# Altium project CT310高端控制盒基板电路V1.1.PrjPcb (part 2 of 2)
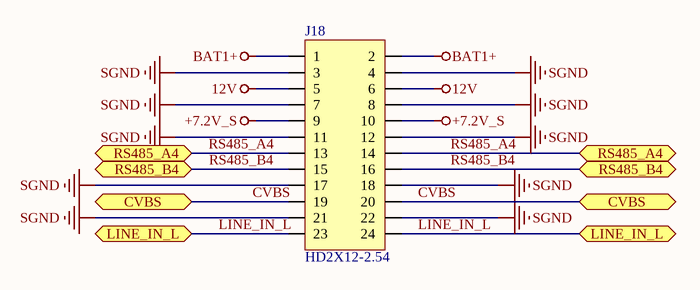
[diagram p13: DataVideoPort.SchDoc]

## Nets that join several sheets
12V: KeyInput_MG (R4.1 R5.1), PowerManager (10 pins), LeftInterface (J17.6), PowerConvert (10 pins), DataVideoPort (J18.5 J18.6)
12V_OUT: OmapSystem (J14.7 J14.8 J14.9 J14.10), PowerManager (K1.5)
+2.5V_S: Processor (C90.1 C91.1 C94.1 U5.21), JoyStickAdcInput (6 pins), PowerConvert (C82.2 C83.2 C84.2 U4.6)
+3.3V_S: Processor (20 pins), KeyInput_IJMEF (10 pins), KeyInput_ABH (21 pins), OmapSystem (R45.1 R53.1), KeyInput_MG (9 pins), TTL_TO_RS232 (C108.1 C112.2 IC1.16), TTL_TO_RS485 (9 pins), PowerConvert (C6.1 C9.2 L1.1)
+5V_OUT: OmapSystem (J13.1 J13.2 J13.3 J13.4), PowerManager (K1.4)
+5V_S: PowerManager (K1.3), LeftInterface (J17.4), PowerConvert (14 pins)
+7.2V_S: PowerConvert (7 pins), DataVideoPort (J18.9 J18.10)
BAT1+: PowerManager (F1.1 K2.3), DataVideoPort (J18.1 J18.2)
SGND: Processor (27 pins), KeyInput_IJMEF (12 pins), JoyStickAdcInput (10 pins), KeyInput_ABH (24 pins), OmapSystem (10 pins), KeyInput_MG (15 pins), PowerManager (23 pins), LeftInterface (7 pins), TTL_TO_RS232 (5 pins), TTL_TO_RS485 (12 pins), PowerConvert (39 pins), DataVideoPort (10 pins)
BAT1_ADC: Processor (U5.23), PowerManager (C15.1 C17.1 R21.2 R27.2)
BAT2_ADC: Processor (U5.24), PowerManager (C16.1 C18.1 R22.2 R28.2)
CVBS: OmapSystem (R46.2 R51.2), DataVideoPort (J18.19 J18.20)
JoyStick_LeftX: Processor (U5.16), JoyStickAdcInput (C23.1 R6.1)
JoyStick_LeftY: Processor (U5.17), JoyStickAdcInput (C25.1 R8.1)
JoyStick_RightX: Processor (U5.26), JoyStickAdcInput (C24.1 R7.1)
JoyStick_RightY: Processor (U5.25), JoyStickAdcInput (C26.1 R29.1)
KeySwIn_ED: Processor (U5.61), KeyInput_IJMEF (C51.1 J16.2 R60.1)
KeySwIn_EL: Processor (U5.60), KeyInput_IJMEF (C54.1 J16.3 R66.1)
KeySwIn_EM: Processor (U5.62), KeyInput_IJMEF (C60.1 J16.5 R78.1)
KeySwIn_ER: Processor (U5.81), KeyInput_IJMEF (C57.1 J16.4 R72.1)
KeySwIn_EU: Processor (U5.82), KeyInput_IJMEF (C48.1 J16.1 R55.1)
KeySwIn_FD: Processor (U5.33), KeyInput_IJMEF (C52.1 J15.2 R61.1)
KeySwIn_FL: Processor (U5.32), KeyInput_IJMEF (C55.1 J15.3 R67.1)
KeySwIn_FM: Processor (U5.31), KeyInput_IJMEF (C61.1 J15.5 R79.1)
KeySwIn_FR: Processor (U5.30), KeyInput_IJMEF (C58.1 J15.4 R73.1)
KeySwIn_FU: Processor (U5.29), KeyInput_IJMEF (C49.1 J15.1 R56.1)
KeySwIn_G1: Processor (U5.63), KeyInput_MG (C63.1 J9.1 R86.1)
KeySwIn_G2: Processor (U5.64), KeyInput_MG (C65.1 J9.3 R90.1)
KeySwIn_H1: Processor (U5.34), KeyInput_ABH (C27.1 J1.1 R13.1)
KeySwIn_H2: Processor (U5.35), KeyInput_ABH (C28.1 J1.2 R14.1)
KeySwIn_H3: Processor (U5.36), KeyInput_ABH (C29.1 J1.3 R15.1)
KeySwIn_H4: Processor (U5.38), KeyInput_ABH (C30.1 J1.4 R16.1)
KeySwIn_H5: Processor (U5.39), KeyInput_ABH (C31.1 J1.5 R17.1)
KeySwIn_I1: Processor (U5.2), KeyInput_MG (C50.1 J7.1 R59.1)
KeySwIn_I2: Processor (U5.3), KeyInput_MG (C71.1 J7.2 R65.1)
KeySwIn_J1: Processor (U5.4), KeyInput_MG (C56.1 J8.1 R71.1)
KeySwIn_J2: Processor (U5.5), KeyInput_MG (C59.1 J8.2 R77.1)
KeySwIn_M2: Processor (U5.97), KeyInput_MG (C62.1 J8.3 R85.1)
KeySwIn_M3: Processor (U5.98), KeyInput_MG (C64.1 J7.3 R89.1)
KeySwIn_M4: Processor (U5.1), KeyInput_MG (C66.1 J7.4 R93.1)
KeySwLed_G1: Processor (U5.65), KeyInput_MG (R122.2)
KeySwLed_G2: Processor (U5.66), KeyInput_MG (R123.2)
KJ_A1: Processor (U5.96), KeyInput_ABH (C32.1 J4.1 R23.1)
KJ_A2: Processor (U5.95), KeyInput_ABH (C36.1 J4.2 R31.1)
KJ_A3: Processor (U5.93), KeyInput_ABH (C40.1 J4.3 R39.1)
KJ_A4: Processor (U5.92), KeyInput_ABH (C44.1 J4.4 R47.1)
KJ_A5: Processor (U5.91), KeyInput_ABH (C33.1 J4.5 R24.1)
KJ_A6: Processor (U5.88), KeyInput_ABH (C37.1 J4.6 R32.1)
KJ_A7: Processor (U5.85), KeyInput_ABH (C41.1 J4.7 R40.1)
KJ_A8: Processor (U5.84), KeyInput_ABH (C45.1 J4.8 R48.1)
KJ_B1: Processor (U5.41), KeyInput_ABH (C34.1 J5.1 R25.1)
KJ_B2: Processor (U5.42), KeyInput_ABH (C38.1 J5.2 R33.1)
KJ_B3: Processor (U5.43), KeyInput_ABH (C42.1 J5.3 R41.1)
KJ_B4: Processor (U5.44), KeyInput_ABH (C46.1 J5.4 R49.1)
KJ_B5: Processor (U5.45), KeyInput_ABH (C35.1 J5.5 R26.1)
KJ_B6: Processor (U5.46), KeyInput_ABH (C39.1 J5.6 R34.1)
KJ_B7: Processor (U5.47), KeyInput_ABH (C43.1 J5.7 R42.1)
KJ_B8: Processor (U5.48), KeyInput_ABH (C47.1 J5.8 R50.1)
LCD_ONOFF: Processor (U5.58), OmapSystem (R45.2 R54.2)
LCD_PWM: Processor (U5.59), OmapSystem (R53.2 R58.2)
PowerCnt: Processor (U5.52), PowerManager (R20.1)
PowerOutCnt: Processor (U5.51), PowerManager (R44.1)
RJ45_RX+: OmapSystem (J13.19 J13.20), LeftInterface (U6.6)
RJ45_RX-: OmapSystem (J13.17 J13.18), LeftInterface (U6.8)
RJ45_TX+: OmapSystem (J13.23 J13.24), LeftInterface (U6.1)
RJ45_TX-: OmapSystem (J13.21 J13.22), LeftInterface (U6.3)
RS232_RXD1: OmapSystem (R57.2), TTL_TO_RS232 (R103.2)
RS232_RXD2: OmapSystem (R43.2), LeftInterface (J19.5)
RS232_TXD1: OmapSystem (R52.2), TTL_TO_RS232 (R102.2)
RS232_TXD2: OmapSystem (R38.2), LeftInterface (J19.6)
RS485_A2: LeftInterface (J17.2), TTL_TO_RS485 (D62.2 R117.1)
RS485_A4: TTL_TO_RS485 (D64.2 R121.1), DataVideoPort (J18.13 J18.14)
RS485_B2: LeftInterface (J17.1), TTL_TO_RS485 (D62.1 R116.1)
RS485_B4: TTL_TO_RS485 (D64.1 R120.1), DataVideoPort (J18.15 J18.16)
SwAdc: Processor (U5.15), PowerManager (5 pins)
UART1_R: Processor (U5.69), TTL_TO_RS232 (IC1.9)
UART1_T: Processor (U5.68), TTL_TO_RS232 (IC1.10)
UART2_E: Processor (U5.57), TTL_TO_RS485 (IC2.2 IC2.3 R104.1)
UART2_R: Processor (U5.56), TTL_TO_RS485 (IC2.1)
UART2_T: Processor (U5.55), TTL_TO_RS485 (IC2.4)
UART3_E: Processor (U5.67), TTL_TO_RS485 (IC3.2 IC3.3 R105.1)
UART3_R: Processor (U5.87), TTL_TO_RS485 (IC3.1)
UART3_T: Processor (U5.86), TTL_TO_RS485 (IC3.4)
UART4_E: Processor (U5.80), TTL_TO_RS485 (IC4.2 IC4.3 R106.1)
UART4_R: Processor (U5.79), TTL_TO_RS485 (IC4.1)
UART4_T: Processor (U5.78), TTL_TO_RS485 (IC4.4)
XuotgDM: OmapSystem (J13.11 J13.12), LeftInterface (R64.2)
XuotgDP: OmapSystem (J13.13 J13.14), LeftInterface (R63.2)
XuotgID: OmapSystem (J13.15 J13.16), LeftInterface (R62.2)
XuotgVBUS: OmapSystem (J13.9 J13.10), LeftInterface (R68.2)